# Altium schematic sheet X2X.SchDoc
size A4
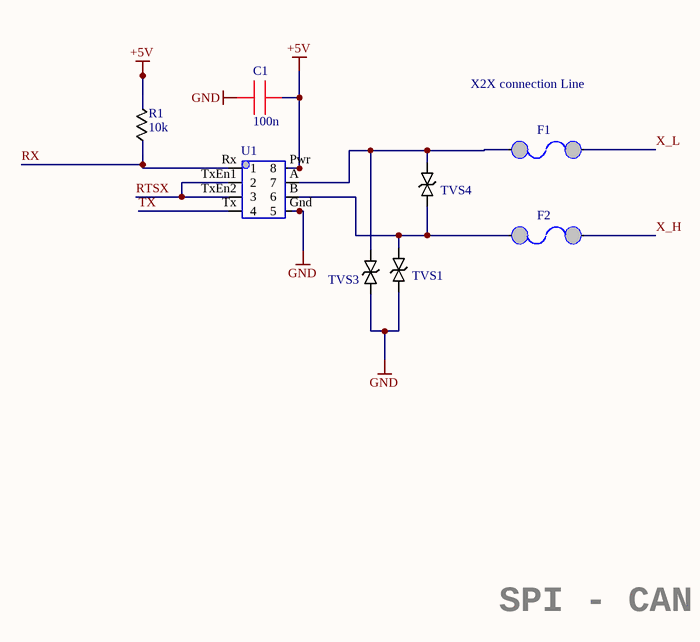
[diagram p0: X2X.SchDoc]

## Parts
C1  100n  [0603 - Cap]
F1  Fuse PTS  [1210_MF]  (value not drawn)
F2  Fuse PTS  [1210_MF]  (value not drawn)
R1  10k  [0603_Res]
TVS1  (no value)  [DO-214AC]
TVS3  (no value)  [DO-214AC]
TVS4  (no value)  [DO-214AC]
U1  (no value)  [MAX485 - duplicate]

## Nets
+5V: C1.1 R1.2 U1.Pwr(8)
GND: C1.2 TVS1.1 TVS3.1 U1.Gnd(5)
RTSX: U1.TxEn1(2) U1.TxEn2(3)
RX: R1.1 U1.Rx(1)
TX: U1.Tx(4)
X_H: F2.1
X_L: F1.1
NetF1_2: F1.2 TVS3.2 TVS4.2 U1.A(7)
NetF2_2: F2.2 TVS1.2 TVS4.1 U1.B(6)

## Notes on the sheet
- X2X connection Line
- SPI - CAN

## Library data of the parts
C1 = 0805 Cap: Part Description: Ceramic Capacitors SMD 50 V 0.1uF X7R 0603 10%; Part Number: CC0603KRX7R9BB104
F1 F2 = Fuse PTS: Part Description: Resettable Fuses - PPTC 30V 50MA; Part Number: MF-USMF005-2
R1 = Resistor 0805: RC0603JR-0710K; Part Description: SMD  Resistor 0603, 10kOhms, 1%, 1/10W; Part Number: RC0603FR-0710KL
TVS1 TVS3 TVS4 = SMAJ5.0CA: Part Description: ESD Diodes 5V 400 W; Part Number: SMAJ5.0CA
U1 = MAX485: Part Description: RS-485 Interface IC Low-Power; Part Number: SN65HVD3082EDR